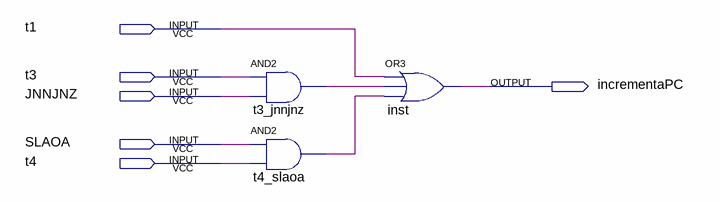
[diagram p0: schematic sheet]
// Quartus schematic incrementa_pc.bdf as structural Verilog: 3 symbols, 6 pins
module incrementa_pc (
  input  t1,
  input  t3,
  input  JNNJNZ,
  input  SLAOA,
  input  t4,
  output incrementaPC
);

  wire t3_jnnjnz_out, t4_slaoa_out;

  and t3_jnnjnz (t3_jnnjnz_out, t3, JNNJNZ);
  and t4_slaoa (t4_slaoa_out, SLAOA, t4);
  or inst (incrementaPC, t1, t3_jnnjnz_out, t4_slaoa_out);
endmodule
